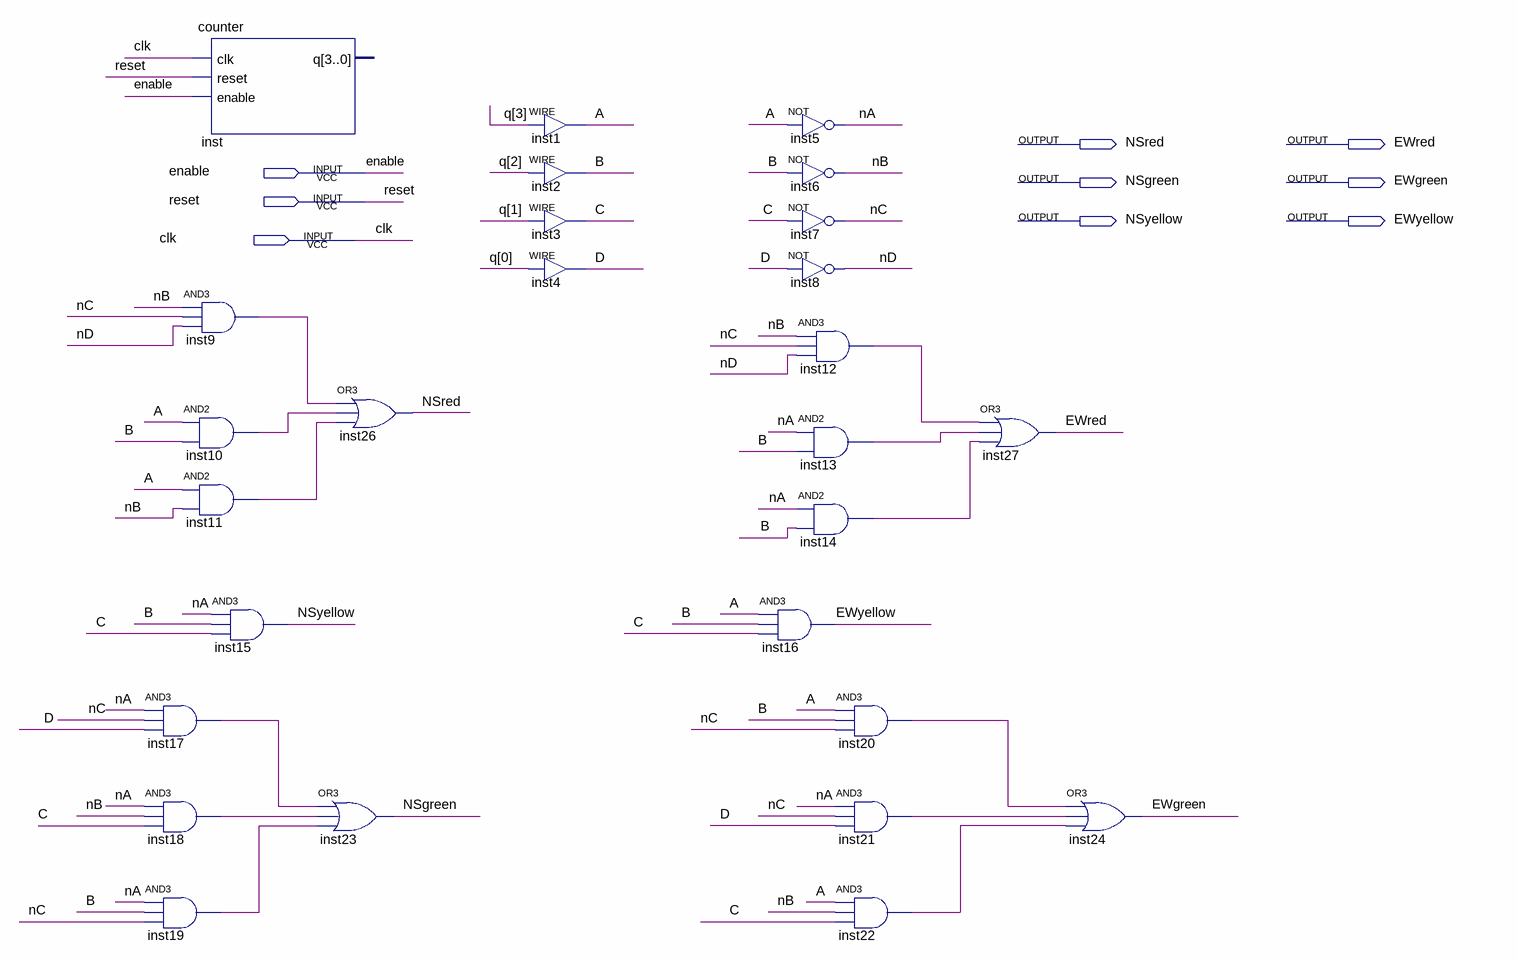
[diagram p0: schematic sheet]
// Quartus schematic traffic.bdf as structural Verilog: 27 symbols, 9 pins
module traffic (
  input  enable,
  input  reset,
  input  clk,
  output NSred,
  output EWred,
  output NSgreen,
  output EWgreen,
  output NSyellow,
  output EWyellow
);

  wire A, B, C, D, inst9_out, inst10_out, inst11_out, inst12_out, inst13_out, inst14_out, inst17_out,
       inst18_out, inst19_out, inst20_out, inst21_out, inst22_out, nA, nB, nC, nD;
  wire [3:0] q;

  counter inst (.clk(clk), .reset(reset), .enable(enable));  // open: q
  and inst9 (inst9_out, nB, nC, nD);
  and inst10 (inst10_out, A, B);
  and inst11 (inst11_out, A, nB);
  and inst15 (NSyellow, nA, B, C);
  and inst17 (inst17_out, nA, nC, D);
  and inst18 (inst18_out, nA, nB, C);
  and inst19 (inst19_out, nA, B, nC);
  or inst26 (NSred, inst9_out, inst10_out, inst11_out);
  or inst23 (NSgreen, inst17_out, inst18_out, inst19_out);
  assign A = q[3];  // WIRE inst1
  assign B = q[2];  // WIRE inst2
  assign C = q[1];  // WIRE inst3
  assign D = q[0];  // WIRE inst4
  not inst5 (nA, A);
  not inst6 (nB, B);
  not inst7 (nC, C);
  not inst8 (nD, D);
  and inst12 (inst12_out, nB, nC, nD);
  and inst13 (inst13_out, nA, B);
  and inst14 (inst14_out, nA, B);
  and inst16 (EWyellow, A, B, C);
  and inst20 (inst20_out, A, B, nC);
  and inst21 (inst21_out, nA, nC, D);
  and inst22 (inst22_out, A, nB, C);
  or inst27 (EWred, inst12_out, inst13_out, inst14_out);
  or inst24 (EWgreen, inst20_out, inst21_out, inst22_out);
endmodule
